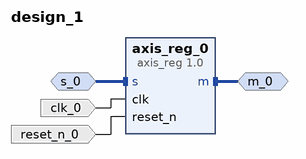
[diagram p0: block diagram of the top level]
# Vivado block design design_1, xczu7ev-ffvc1156-2-e, Vivado 2022.2.2
create_bd_design design_1

create_bd_intf_port -mode Master -vlnv xilinx.com:interface:axis_rtl:1.0 m_0
create_bd_intf_port -mode Slave -vlnv xilinx.com:interface:axis_rtl:1.0 s_0
set_property -dict [list \
  CONFIG.HAS_TKEEP 0 \
  CONFIG.HAS_TLAST 1 \
  CONFIG.HAS_TREADY 1 \
  CONFIG.HAS_TSTRB 0 \
  CONFIG.LAYERED_METADATA undef \
  CONFIG.TDATA_NUM_BYTES 1 \
  CONFIG.TDEST_WIDTH 0 \
  CONFIG.TID_WIDTH 0 \
  CONFIG.TUSER_WIDTH 0 \
] [get_bd_intf_ports s_0]
create_bd_port -dir I -type clk clk_0
create_bd_port -dir I -type rst reset_n_0

create_bd_cell -type ip -vlnv user.org:user:axis_reg:1.0 axis_reg_0

# ---- connections ----

connect_bd_intf_net [get_bd_intf_ports m_0] [get_bd_intf_pins axis_reg_0/m]
connect_bd_intf_net -intf_net s_0_1 [get_bd_intf_ports s_0] [get_bd_intf_pins axis_reg_0/s]
connect_bd_net -net clk_0_1 [get_bd_ports clk_0] [get_bd_pins axis_reg_0/clk]
connect_bd_net -net reset_n_0_1 [get_bd_ports reset_n_0] [get_bd_pins axis_reg_0/reset_n]

validate_bd_design
save_bd_design
